# Altium schematic sheet LV_BUCK.SchDoc (part 1 of 3)
size A; SheetNumber: 6; SheetTotal: 8
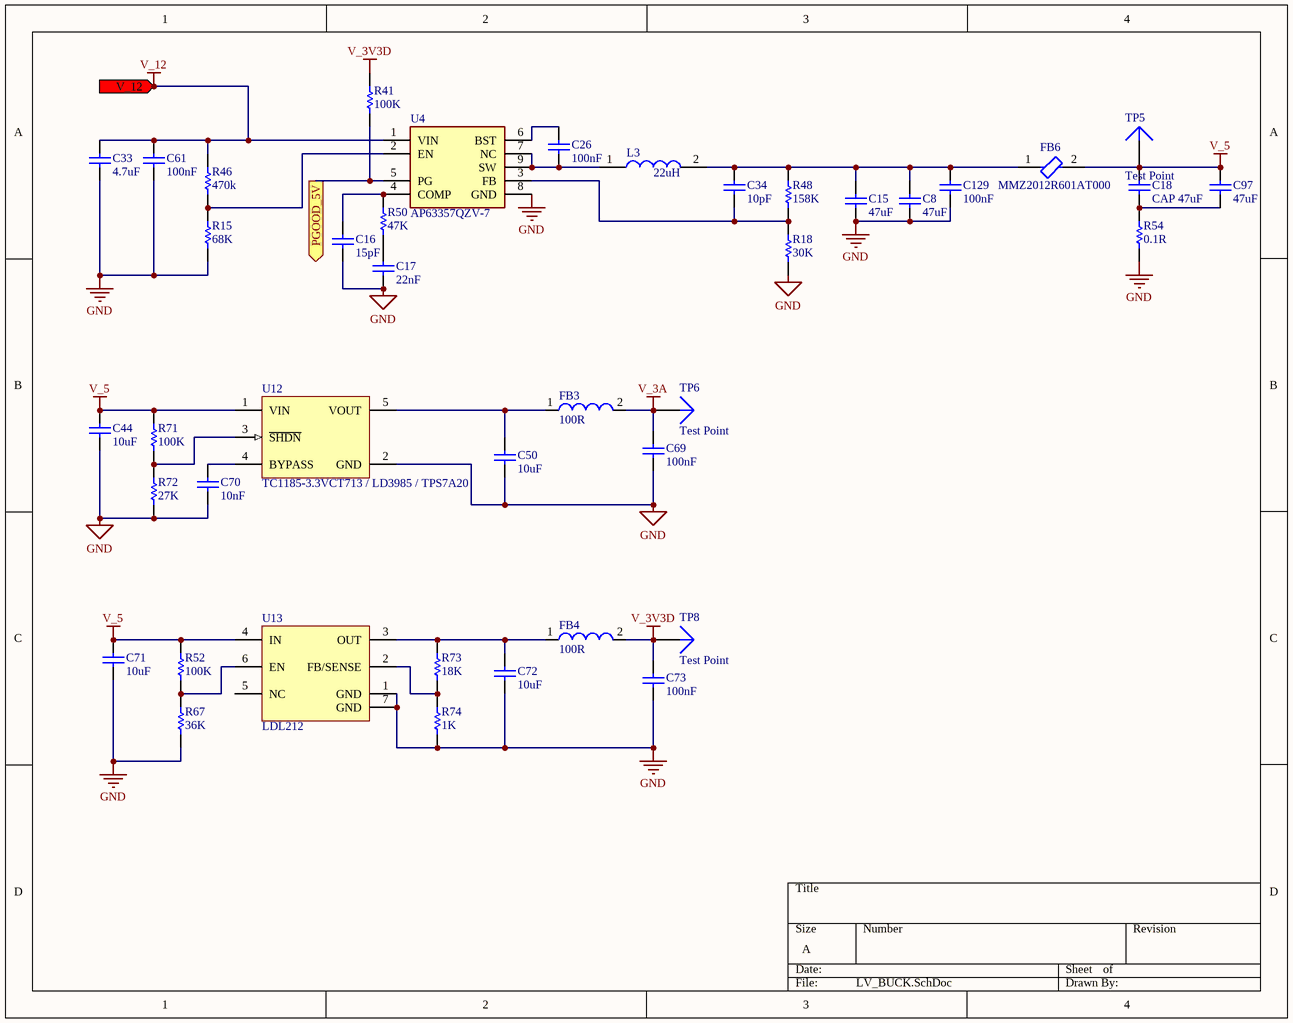
[diagram p0: LV_BUCK.SchDoc]

## Parts
C8  47uF  [CAPC1206(3216)190_N]
C15  47uF  [CAPC1206(3216)190_N]
C16  15pF  [CAPC1005X56X25NL10T15]
C17  22nF  [CAPC1005X56X25NL10T15]
C18  CAP 47uF  [CAPC1210(3225)280_M]
C26  100nF  [CAPC1005X56X25NL10T15]
C33  4.7uF  [CAPC3216X180X50NL20T25]
C34  10pF  [CAPC1005X56X25NL10T15]
C44  10uF  [CAPC2013X140X45NL15T25]
C50  10uF  [CAPC2013X140X45NL15T25]
C61  100nF  [CAPC1608X90X35NL10T15]
C69  100nF  [CAPC1608X90X35NL10T15]
C70  10nF  [CAPC1608X90X35NL10T15]
C71  10uF  [CAPC2013X140X45NL15T25]
C72  10uF  [CAPC2013X140X45NL15T25]
C73  100nF  [CAPC1608X90X35NL10T15]
C97  47uF  [CAPC1206(3216)190_N]
C129  100nF  [CAPC1005X56X25NL10T15]
FB3  100R  [SMD-0603]
FB4  100R  [SMD-0603]
FB6  MMZ2012R601AT000  [FP-MMZ2012-IPC_A]
L3  22uH  [INDPM8680X400N]
R15  68K  [RESC1005X40X25NL05T05]
R18  30K  [RESC1005X40X25NL05T05]
R41  100K  [RESC1005X40X25NL05T10]
R46  470k  [RESC1005X40X25NL05T05]
R48  158K  [RESC1005X40X25NL05T05]
R50  47K  [RESC1005X40X25NL05T05]
R52  100K  [RESC1608X55X25NL10T15]
R54  0.1R  [RESC1608X55X25ML10T15]
R67  36K  [RESC1608X55X25NL10T15]
R71  100K  [RESC1608X55X25NL10T15]
R72  27K  [RESC1608X55X25NL10T15]
R73  18K  [RESC1608X55X30NL20T20]
R74  1K  [RESC1608X55X30NL15T15]
TP5  Test Point  [TP1.5mm]
TP6  Test Point  [TP1.5mm]
TP8  Test Point  [TP1.5mm]
U4  AP63357QZV-7  [AP63357QZV7]
U12  TC1185-3.3VCT713 / LD3985 / TPS7A20  [SOT23-5]
U13  LDL212  [LDL212PUR]

## Ports
PGOOD_5V (out), V_12 (in)

## Nets
GND: C8.1 C15.1 C16.1 C17.1 C33.1 C44.1 C50.1 C61.1 C69.1 C70.1 C71.1 C72.1 C73.1 C129.1 R15.1 R18.1 R54.1 R67.1 R72.1 R74.1 U4.8(GND) U12.2(GND) U13.1(GND) U13.7(GND)
V_3A: C69.2 FB3.2 TP6.1
V_3V3D: C73.2 FB4.2 R41.2 TP8.1
V_5: C18.2 C44.2 C71.2 C97.2 FB6.2 R52.2 R71.2 TP5.1 U12.1(VIN) U13.4(IN)
V_12: C33.2 C61.2 R46.2 U4.1(VIN) ; port V_12
PGOOD_5V: R41.1 U4.5(PG) ; port PGOOD_5V
NetC8_2: C8.2 C15.2 C34.2 C129.2 FB6.1 L3.2 R48.2
NetC16_2: C16.2 R50.2 U4.4(COMP)
NetC17_2: C17.2 R50.1
NetC18_1: C18.1 C97.1 R54.2
NetC26_1: C26.1 L3.1 U4.7(NC) U4.9(SW)
NetC26_2: C26.2 U4.6(BST)
NetC34_1: C34.1 R18.2 R48.1 U4.3(FB)
NetC50_2: C50.2 FB3.1 U12.5(VOUT)
NetC70_2: C70.2 U12.4(BYPASS)
NetC72_2: C72.2 FB4.1 R73.2 U13.3(OUT)
NetR15_2: R15.2 R46.1 U4.2(EN)
NetR52_1: R52.1 R67.2 U13.6(EN)
NetR71_1: R71.1 R72.2 U12.3(~{SHDN})
NetR73_1: R73.1 R74.2 U13.2(FB/SENSE)

Not connected (* = marked no-connect by the designer): U13 5(NC)